# Altium schematic sheet IC106.schdoc
size 72 x 114 mm
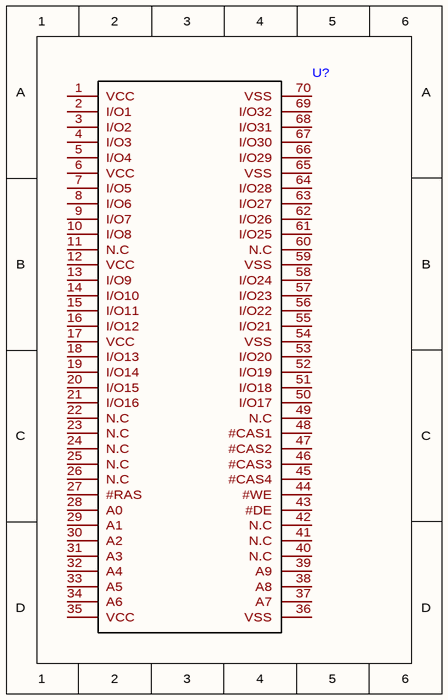
[diagram p0: IC106.schdoc]

## Parts
U?  (no value)  [SOJ-70_L27.0-W10.0-BL]

## Nets

Not connected (* = marked no-connect by the designer): U? 1(VCC) 2(I/O1) 3(I/O2) 4(I/O3) 5(I/O4) 6(VCC) 7(I/O5) 8(I/O6) 9(I/O7) 10(I/O8) 11(N.C) 12(VCC) 13(I/O9) 14(I/O10) 15(I/O11) 16(I/O12) 17(VCC) 18(I/O13) 19(I/O14) 20(I/O15) 21(I/O16) 22(N.C) 23(N.C) 24(N.C) 25(N.C) 26(N.C) 27(#RAS) 28(A0) 29(A1) 30(A2) 31(A3) 32(A4) 33(A5) 34(A6) 35(VCC) 36(VSS) 37(A7) 38(A8) 39(A9) 40(N.C) 41(N.C) 42(N.C) 43(#DE) 44(#WE) 45(#CAS4) 46(#CAS3) 47(#CAS2) 48(#CAS1) 49(N.C) 50(I/O17) 51(I/O18) 52(I/O19) 53(I/O20) 54(VSS) 55(I/O21) 56(I/O22) 57(I/O23) 58(I/O24) 59(VSS) 60(N.C) 61(I/O25) 62(I/O26) 63(I/O27) 64(I/O28) 65(VSS) 66(I/O29) 67(I/O30) 68(I/O31) 69(I/O32) 70(VSS)

## Library data of the parts
U? = IC106